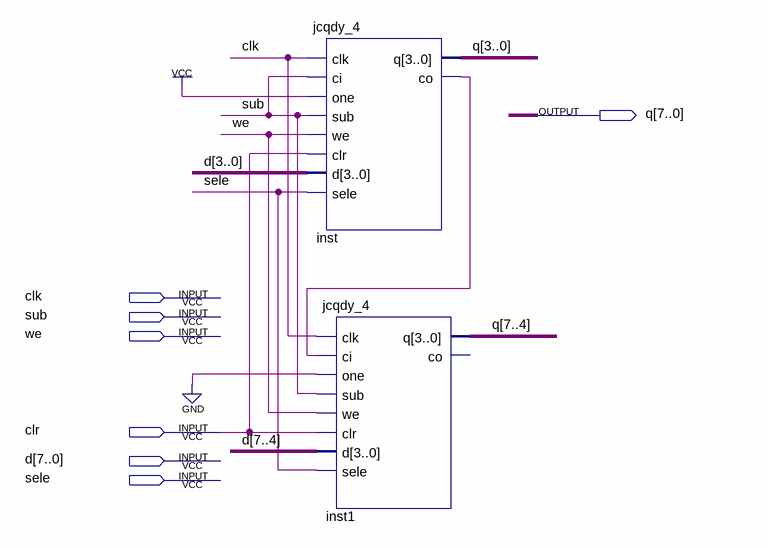
[diagram p0: schematic sheet]
// Quartus schematic jshq_8.bdf as structural Verilog: 2 symbols, 7 pins
module jshq_8 (
  input  clk,
  input  sub,
  input  we,
  input  clr,
  input  [7:0] d,
  input  sele,
  output [7:0] q
);

  wire inst_co;

  jcqdy_4 inst (
    .clk(clk), .ci(sub), .one(1'b1), .sub(sub), .we(we), .clr(clr), .d(d[3:0]), .sele(sele), .q(q[3:0]),
    .co(inst_co));
  jcqdy_4 inst1 (
    .clk(clk), .ci(inst_co), .one(1'b0), .sub(sub), .we(we), .clr(clr), .d(d[7:4]), .sele(sele), .q(q[7:4]));  // open: co
endmodule
